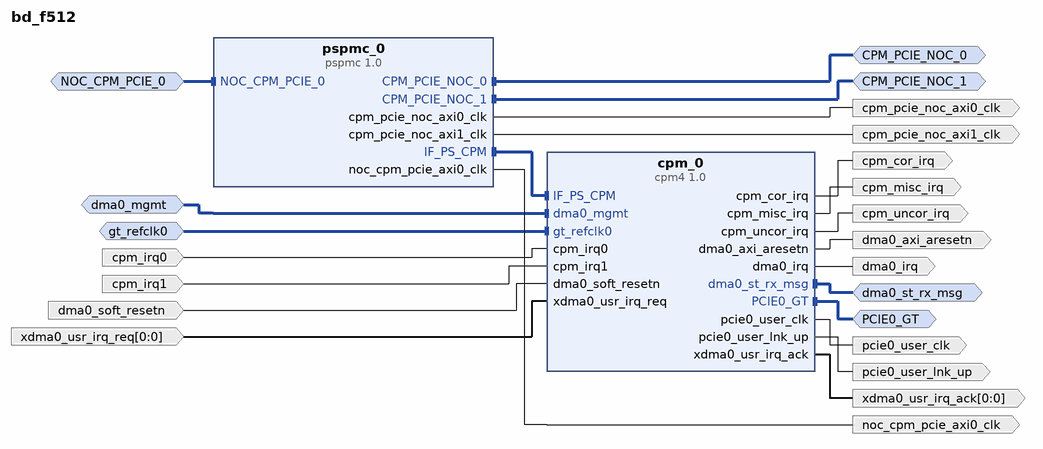
[diagram p0: block diagram of the top level]
# Vivado block design bd_f512, xcvc1902-vsva2197-2MP-e-S, Vivado 2021.1
create_bd_design bd_f512

create_bd_intf_port -mode Slave -vlnv xilinx.com:interface:aximm_rtl:1.0 NOC_CPM_PCIE_0
set_property -dict {CONFIG.INDEX 0} [get_bd_intf_ports NOC_CPM_PCIE_0]
create_bd_intf_port -mode Master -vlnv xilinx.com:interface:aximm_rtl:1.0 CPM_PCIE_NOC_0
set_property -dict {CONFIG.INDEX 0} [get_bd_intf_ports CPM_PCIE_NOC_0]
create_bd_intf_port -mode Master -vlnv xilinx.com:interface:aximm_rtl:1.0 CPM_PCIE_NOC_1
set_property -dict {CONFIG.INDEX 1} [get_bd_intf_ports CPM_PCIE_NOC_1]
create_bd_intf_port -mode Master -vlnv xilinx.com:interface:gt_rtl:1.0 PCIE0_GT
create_bd_intf_port -mode Slave -vlnv xilinx.com:interface:cpm_dma_mgmt_rtl:1.0 dma0_mgmt
create_bd_intf_port -mode Master -vlnv xilinx.com:interface:axis_rtl:1.0 dma0_st_rx_msg
set_property -dict {CONFIG.FREQ_HZ 250000000} [get_bd_intf_ports dma0_st_rx_msg]
create_bd_intf_port -mode Slave -vlnv xilinx.com:interface:diff_clock_rtl:1.0 gt_refclk0
set_property -dict {CONFIG.FREQ_HZ 100000000} [get_bd_intf_ports gt_refclk0]
create_bd_port -dir O -type clk noc_cpm_pcie_axi0_clk
create_bd_port -dir O -type clk cpm_pcie_noc_axi0_clk
create_bd_port -dir O -type clk cpm_pcie_noc_axi1_clk
create_bd_port -dir O -type clk pcie0_user_clk
set_property -dict {CONFIG.ASSOCIATED_RESET dma0_axi_aresetn CONFIG.FREQ_HZ 250000000} [get_bd_ports pcie0_user_clk]
create_bd_port -dir O pcie0_user_lnk_up
create_bd_port -dir O -type intr cpm_misc_irq
create_bd_port -dir O -type intr cpm_cor_irq
create_bd_port -dir O -type intr cpm_uncor_irq
create_bd_port -dir I -type intr cpm_irq0
create_bd_port -dir I -type intr cpm_irq1
create_bd_port -dir O -type intr dma0_irq
create_bd_port -dir O -type rst dma0_axi_aresetn
set_property -dict {CONFIG.POLARITY ACTIVE_LOW} [get_bd_ports dma0_axi_aresetn]
create_bd_port -dir I -type rst dma0_soft_resetn
set_property -dict {CONFIG.POLARITY ACTIVE_LOW} [get_bd_ports dma0_soft_resetn]
create_bd_port -dir O -from 0 -to 0 xdma0_usr_irq_ack
create_bd_port -dir I -from 0 -to 0 xdma0_usr_irq_req

create_bd_cell -type ip -vlnv xilinx.com:ip:pspmc:1.0 pspmc_0
